# EAGLE design Adafruit Arcade Bonnet (EAGLE 6.6.0)
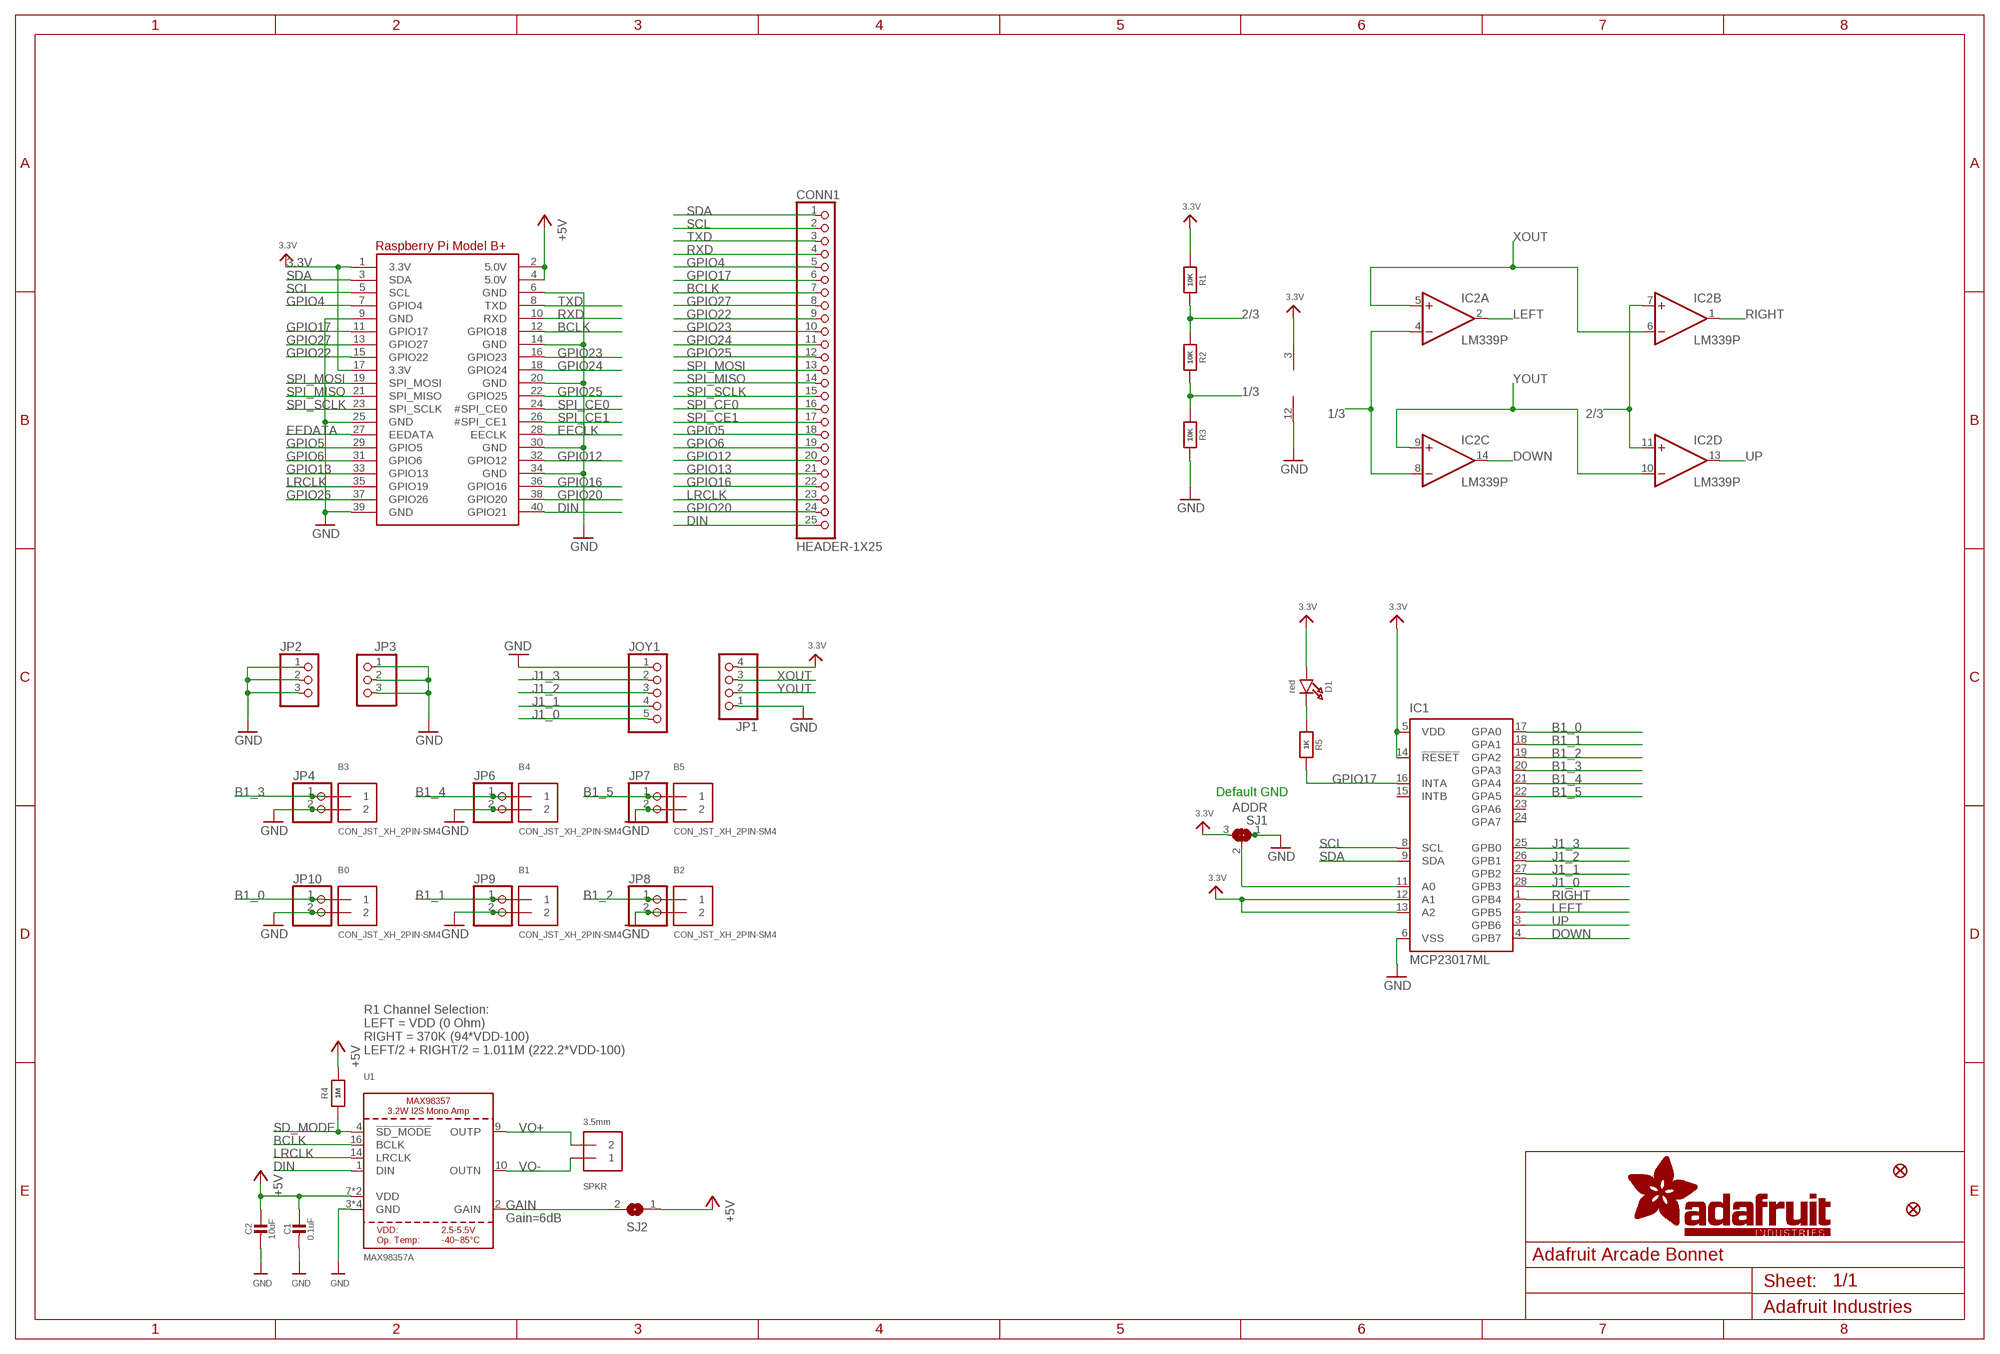
[diagram p0: schematic, sheet 1]

## Parts
B0  CON_JST_XH_2PIN-SM4  [JST-XH-2-SM4]
B1  CON_JST_XH_2PIN-SM4  [JST-XH-2-SM4]
B2  CON_JST_XH_2PIN-SM4  [JST-XH-2-SM4]
B3  CON_JST_XH_2PIN-SM4  [JST-XH-2-SM4]
B4  CON_JST_XH_2PIN-SM4  [JST-XH-2-SM4]
B5  CON_JST_XH_2PIN-SM4  [JST-XH-2-SM4]
C1  0.1uF  CAP_CERAMIC0603_NO  [0603-NO]
C2  10uF  CAP_CERAMIC0805-NOOUTLINE  [0805-NO]
CONN1  HEADER-1X25  [1X25_ROUND_70MIL]
D1  red  LED0805_NOOUTLINE  [CHIPLED_0805_NOOUTLINE]
FID2  FIDUCIAL""  [FIDUCIAL_1MM]
FID3  FIDUCIAL""  [FIDUCIAL_1MM]
IC1  MCP23017ML  [QFN28-ML_6X6MM]
IC2  LM339P  [TSSOP14]
JOY1  HEADER-1X5  [1X05_OVAL]
JP1  HEADER-1X4  [1X04_OVAL]
JP2  HEADER-1X3ROUND  [1X03_ROUND]
JP3  HEADER-1X3ROUND  [1X03_ROUND]
JP4  HEADER-1X2  [1X02_OVAL]
JP6  HEADER-1X2  [1X02_OVAL]
JP7  HEADER-1X2  [1X02_OVAL]
JP8  HEADER-1X2  [1X02_OVAL]
JP9  HEADER-1X2  [1X02_OVAL]
JP10  HEADER-1X2  [1X02_OVAL]
R1  10K  RESISTOR0805_10MGAP  [0805_10MGAP]
R2  10K  RESISTOR0805_NOOUTLINE  [0805-NO]
R3  10K  RESISTOR0805_NOOUTLINE  [0805-NO]
R4  1M  RESISTOR_0603_NOOUT  [0603-NO]
R5  1K  RESISTOR_0603_NOOUT  [0603-NO]
RPI1  RASPBERRYPI_BPLUS_PHAT  [PI_BONNET]
SJ1  ADDR  SOLDERJUMPER_2WAY  [SOLDERJUMPER_2WAY_OPEN_NOPASTE]
SJ2  SOLDERJUMPERCLOSED  [SOLDERJUMPER_CLOSEDWIRE]
SPKR  3.5mm  TERMBLOCK_1X2  [TERMBLOCK_1X2-3.5MM]
U1  MAX98357A  AUDIOAMP_MAX98357  [QFN16_3MM]

## Nets
1/3: IC2.4(A:-IN) IC2.8(C:-IN) R2.2 R3.1
2/3: IC2.7(B:+IN) IC2.11(D:+IN) R1.2 R2.1
3.3V: D1.A IC1.5(VDD) IC1.12(A1) IC1.13(A2) IC1.14(!RESET) IC2.3(P:V+) JP1.4 R1.1 RPI1.1(3.3V) RPI1.17(3.3V) SJ1.3
+5V: C1.1 C2.1 R4.2 RPI1.2(5.0V) RPI1.4(5.0V) SJ2.1 U1.7(VDD) U1.8(VDD)
B1_0: B0.1 IC1.17(GPA0) JP10.1
B1_1: B1.1 IC1.18(GPA1) JP9.1
B1_2: B2.1 IC1.19(GPA2) JP8.1
B1_3: B3.1 IC1.20(GPA3) JP4.1
B1_4: B4.1 IC1.21(GPA4) JP6.1
B1_5: B5.1 IC1.22(GPA5) JP7.1
BCLK: CONN1.7 RPI1.12(GPIO18) U1.16(BCLK)
DIN: CONN1.25 RPI1.40(GPIO21) U1.1(DIN)
DOWN: IC1.4(GPB7) IC2.14(C:OUT)
EECLK: RPI1.28(EECLK)
EEDATA: RPI1.27(EEDATA)
GAIN: SJ2.2 U1.2(GAIN)
GND: B0.2 B1.2 B2.2 B3.2 B4.2 B5.2 C1.2 C2.2 IC1.6(VSS) IC2.12(P:GND) JOY1.1 JP1.1 JP2.1 JP2.2 JP2.3 JP3.1 JP3.2 JP3.3 JP4.2 JP6.2 JP7.2 JP8.2 JP9.2 JP10.2 R3.2 RPI1.6(GND) RPI1.9(GND) RPI1.14(GND) RPI1.20(GND) RPI1.25(GND) RPI1.30(GND) RPI1.34(GND) RPI1.39(GND) SJ1.1 U1.3(GND) U1.11(GND) U1.15(GND) U1.THERMAL(GND)
GPIO4: CONN1.5 RPI1.7(GPIO4)
GPIO5: CONN1.18 RPI1.29(GPIO5)
GPIO6: CONN1.19 RPI1.31(GPIO6)
GPIO12: CONN1.20 RPI1.32(GPIO12)
GPIO13: CONN1.21 RPI1.33(GPIO13)
GPIO16: CONN1.22 RPI1.36(GPIO16)
GPIO17: CONN1.6 IC1.16(INTA) R5.2 RPI1.11(GPIO17)
GPIO20: CONN1.24 RPI1.38(GPIO20)
GPIO22: CONN1.9 RPI1.15(GPIO22)
GPIO23: CONN1.10 RPI1.16(GPIO23)
GPIO24: CONN1.11 RPI1.18(GPIO24)
GPIO25: CONN1.12 RPI1.22(GPIO25)
GPIO26: RPI1.37(GPIO26)
GPIO27: CONN1.8 RPI1.13(GPIO27)
J1_0: IC1.28(GPB3) JOY1.5
J1_1: IC1.27(GPB2) JOY1.4
J1_2: IC1.26(GPB1) JOY1.3
J1_3: IC1.25(GPB0) JOY1.2
LEFT: IC1.2(GPB5) IC2.2(A:OUT)
LRCLK: CONN1.23 RPI1.35(GPIO19) U1.14(LRCLK)
N$1: IC1.11(A0) SJ1.2
N$2: D1.C R5.1
RIGHT: IC1.1(GPB4) IC2.1(B:OUT)
RXD: CONN1.4 RPI1.10(RXD)
SCL: CONN1.2 IC1.8(SCL) RPI1.5(SCL)
SD_MODE: R4.1 U1.4(!SD_MODE)
SDA: CONN1.1 IC1.9(SDA) RPI1.3(SDA)
SPI_CE0: CONN1.16 RPI1.24(#SPI_CE0)
SPI_CE1: CONN1.17 RPI1.26(#SPI_CE1)
SPI_MISO: CONN1.14 RPI1.21(SPI_MISO)
SPI_MOSI: CONN1.13 RPI1.19(SPI_MOSI)
SPI_SCLK: CONN1.15 RPI1.23(SPI_SCLK)
TXD: CONN1.3 RPI1.8(TXD)
UP: IC1.3(GPB6) IC2.13(D:OUT)
VO+: SPKR.2 U1.9(OUTP)
VO-: SPKR.1 U1.10(OUTN)
XOUT: IC2.5(A:+IN) IC2.6(B:-IN) JP1.3
YOUT: IC2.9(C:+IN) IC2.10(D:-IN) JP1.2
Unconnected: IC1.15(INTB) IC1.23(GPA6) IC1.24(GPA7)

## Notes on the sheet
- Default GND
- R1 Channel Selection:
  LEFT = VDD (0 Ohm)
  RIGHT = 370K (94*VDD-100)
  LEFT/2 + RIGHT/2 = 1.011M (222.2*VDD-100)
- Gain=6dB

## Library data of the parts
B0 B1-B5 = microbuilder:CON_JST_XH_2PIN
C1 C2 = microbuilder:CAP_CERAMIC: Ceramic Capacitors For new designs, use the packages preceded by an '_' character since they are more reliable: The following footprints should be used on most boards: _0402 - Standard footprint for regular board layouts _0603 - Standard footprint for regular board layouts _0805 - Standard footprint for regular board layouts _1206 - Standard footprint for regular board layouts For extremely tight-pitch boards where space is at a premium, the following 'micro-pitch' footprints can be used (smaller pads, no silkscreen outline, etc.): _0402MP - Micro-pitch footprint for very dense/compact boards _0603MP - Micro-pitch footprint for very dense/compact boards _0805MP - Micro-pitch footprint for very dense/compact boards _1206MP - Micro-pitch footprint for very dense/compact boards
CONN1 = microbuilder:HEADER-1X25
D1 = microbuilder:LED: LED 0603 - 0603 Surface Mount Package 2mA: Green LED - Low Power (3.9mcd, 2ma, 1.7Vf) - Digikey: 475-2709-2-ND Orange LED - Low Power (9.8mcd, 2ma, 1.8Vf) - Digikey: 475-1194-2-ND Red LED - Low Power (5mcd, 2ma, 1.8Vf) - Digikey: 475-1195-2-ND Yellow LED - Low Power (7mcd, 2ma, 1.8Vf) - Digikey: 475-1196-2-ND 5mA: Blue LED - Low Power (17mcd, 5ma, 2.9Vf) - Digikey: LNJ937W8CRACT-ND 0805 - 0805 Surface Mount Package 2mA: Red LED (8.8mcd, 2mA, 1.8Vf, Clear) - Low Power [Digikey: 475-2510-1-ND] Green LED (5mcd, 2mA, 1.8Vf, Clear) - Low Power [Digikey: 475-2730-1-ND] Yellow LED (11.3mcd, 2mA, 1.8Vf, Clear) - Low Power [Digikey: 475-2555-1-ND] 20mA: Red LED (104mcd, 20mA, Diffused) - LS R976 [Digikey: 475-1278-6-ND] Red LED (12mcd, 20mA, 2.0Vf, Clear) - APT2012EC [Digikey: 754-1128-1-ND] Green LED (15mcd, 20mA, 2.2Vf, Clear) - APT2012GC [Digikey: 754-1131-1-ND] Orange LED (160mcd, 20mA, 2.1Vf, Clear) - APT2012SECK [Digikey: 754-1130-1-ND] 1206 - 1206 Surface Mount Package Green LED (26mcd, 20mA, Diffused) - LG N971 [Digikey: 475-1407-6-ND] Red LED (15mcd, 20mA, Diffused) - LH N974 [Digikey: 475-1416-6-ND] Cree - Cree High-Power Surface Mount LEDs XPEBWT-L1-0000-00D50 - White 111lm 350mA 2.9Vf 6200K 110° XTEAWT-00-0000-00000LEE3 - White 114lm 350mA 2.85Vf 5000K 115° Everlight - Everlight 45-21 Series Surface Mount LEDs 45-21/QK2C-B2832AC2CB2/2T - Warm White 2000mcd 20mA 3.25Vf 3050K 120° 45-21/LK2C-B38452C4CB2/2T - Nuetral White 2000mcd 20mA 3.25Vf 4150K 120° 45-21/LK2C-B50634C6CB2/2T - Cold White 2200mcd 20mA 3.25Vf 5650K 120° PLCC2 Reverse Mount LS T77K-J1L2-1-0-2-R18-Z - Red 11.25mcd 2mA 1.8Vf 630nm 120° LO T77K-L1M2-24-Z - Orange 19.6mcd 2mA 1.8Vf 606nm 120° LY T77K-K2M1-26-Z - Yellow 15.7mcd 2mA 1.8Vf 587nm 120°
FID2 FID3 = microbuilder:FIDUCIAL: Fiducial Alignment Points Various fiducial points for machine vision alignment.; BOM: EXCLUDE
IC1 = microbuilder:MCP23017: http://ww1.microchip.com/downloads/en/DeviceDoc/21952a.pdf Source: http://ww1.microchip.com/downloads/en/DeviceDoc/21952a.pdf; MF: MICROCHIP; MPN: MCP23017-E/SS; OC_FARNELL: 1467674; OC_NEWARK: 31K2960
IC2 = microbuilder:LM339: Low Power Low Offset Voltage Quad Comparators with open collector; LM139/LM239/LM339/LM2901/LM3302
JOY1 = microbuilder:HEADER-1X5: PIN HEADER
JP1 = microbuilder:HEADER-1X4: PIN HEADER
JP2 JP3 = microbuilder:HEADER-1X3: PIN HEADER
JP4 JP6-JP10 = microbuilder:HEADER-1X2: PIN HEADER
R1-R5 = microbuilder:RESISTOR: Resistors For new designs, use the packages preceded by an '_' character since they are more reliable: The following footprints should be used on most boards: _0402 - Standard footprint for regular board layouts _0603 - Standard footprint for regular board layouts _0805 - Standard footprint for regular board layouts _1206 - Standard footprint for regular board layouts For extremely tight-pitch boards where space is at a premium, the following 'micro-pitch' footprints can be used (smaller pads, no silkscreen outline, etc.): _0402MP - Micro-pitch footprint for very dense/compact boards _0603MP - Micro-pitch footprint for very dense/compact boards _0805MP - Micro-pitch footprint for very dense/compact boards _1206MP - Micro-pitch footprint for very dense/compact boards
RPI1 = microbuilder:RASPBERRYPI_BPLUS
SJ1 = microbuilder:SOLDERJUMPER_2WAY: 2-Way Solder Jumper
SJ2 = microbuilder:SOLDERJUMPER: SMD Solder JUMPER Solder the two pads together to create a connection, or remove the solder to break it. REFLOW - Use this footprint for solder paste and reflow ovens. WAVE - Use this footprint for hand-soldering (larger pads). CLOSED - Has a trace between the two pads to ensure it is closed by default. The trace needs to be cut to disable the jumper, and can be closed again by creating a solder bridge between the two pads.
SPKR = microbuilder:TERMBLOCK_1X2: 3.5mm Terminal block http://www.ladyada.net/library/pcb/eaglelibrary.html
U1 = microbuilder:AUDIOAMP_MAX98357: MAX98357 - 3.2W I2S Mono Audio Amp

## Board
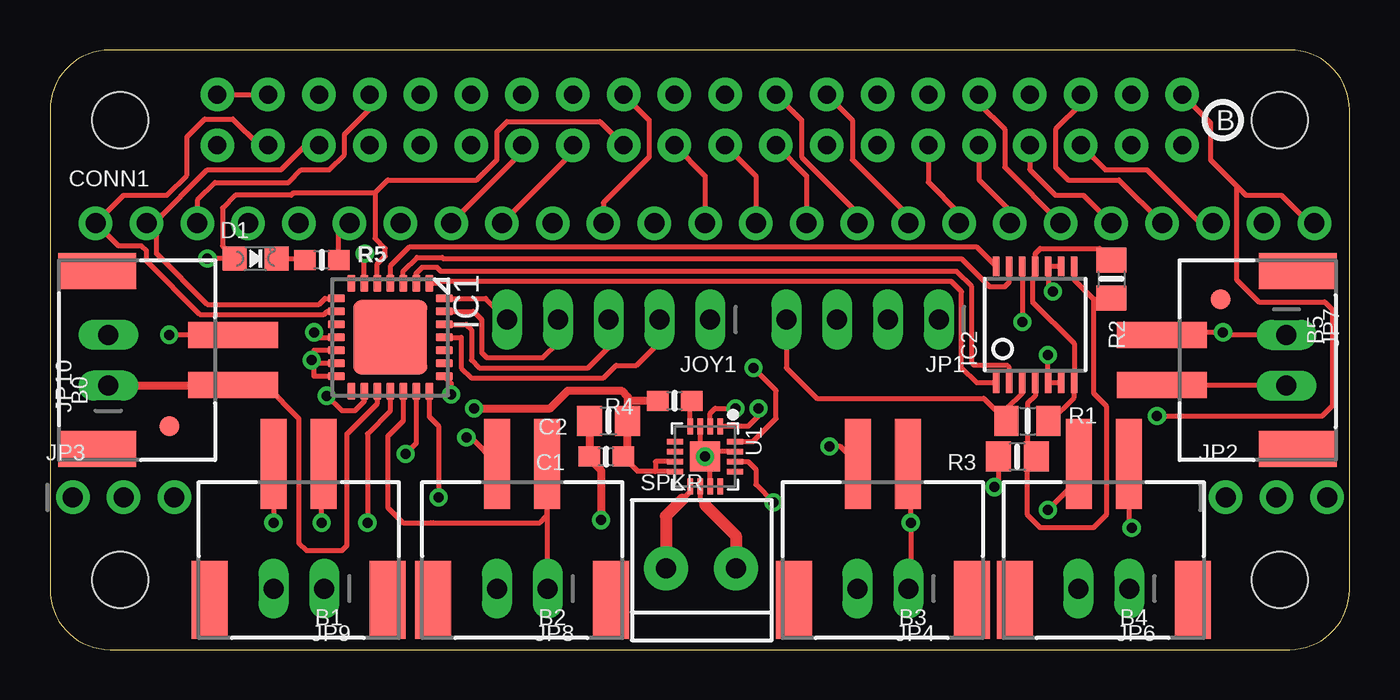
[diagram p1: board, top side]
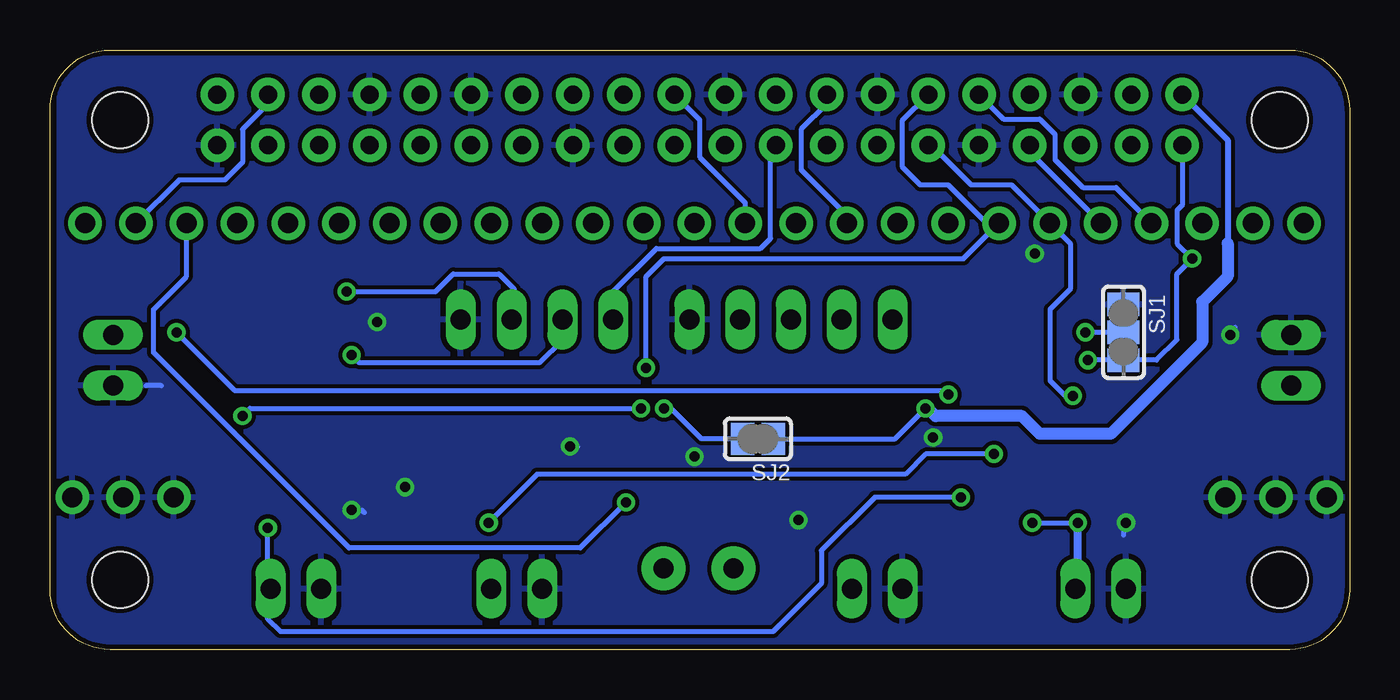
[diagram p2: board, bottom side, seen from below]

Size 65 x 30 mm. Coordinates in mm from the lower left corner, seen from the top.
Copper layers (1*16): Top 0.035mm / dielectric 1.5mm / Bottom 0.035mm
Design rules "adafruit *": minimum track width 8mil, minimum drill 15.5mil, track to track 8mil, track to pad 8mil, pad to pad 8mil, via to via 8mil, smd to smd 8mil, copper to edge 10mil, drill to drill 8mil, minimum pad ring 10mil, minimum via ring 8mil, stop-mask expansion 2mil, vias tented up to drill 20mil, thermal gap 10mil

### Footprints (pad centres in the part's own frame; a part is rotated, then mirrored left to right if it is on the bottom)
JST-XH-2-SM4 = smd 1.3 x 4.5: 1 -1.25,-2.3; 2 1.25,-2.3 | smd 1.8 x 3.9: NC1 -4.45,4.5; NC2 4.45,4.5
0603-NO = smd 1.075 x 1: 1 -0.85,0; 2 0.85,0
0805-NO = smd 1.24 x 1.5: 1 -0.95,0; 2 0.95,0
1X25_ROUND_70MIL = drill 1 pad 1.676: 1 -30.48,0; 2 -27.94,0; 3 -25.4,0; 4 -22.86,0; 5 -20.32,0; 6 -17.78,0; 7 -15.24,0; 8 -12.7,0; 9 -10.16,0; 10 -7.62,0; 11 -5.08,0; 12 -2.54,0; 13 0,0; 14 2.54,0; 15 5.08,0; 16 7.62,0; 17 10.16,0; 18 12.7,0; 19 15.24,0; 20 17.78,0; 21 20.32,0; 22 22.86,0; 23 25.4,0; 24 27.94,0; 25 30.48,0
CHIPLED_0805_NOOUTLINE = smd 1.2 x 1.2: A 0,-1.05; C 0,1.05
FIDUCIAL_1MM = smd 1 x 1: 1 0,0
QFN28-ML_6X6MM = smd 0.85 x 0.4: 1 -2.7,1.95; 2 -2.7,1.3; 3 -2.7,0.65; 4 -2.7,0; 5 -2.7,-0.65; 6 -2.7,-1.3; 7 -2.7,-1.95; 15 2.7,-1.95; 16 2.7,-1.3; 17 2.7,-0.65; 18 2.7,0; 19 2.7,0.65; 20 2.7,1.3; 21 2.7,1.95 | smd 0.4 x 0.85: 8 -1.95,-2.7; 9 -1.3,-2.7; 10 -0.65,-2.7; 11 0,-2.7; 12 0.65,-2.7; 13 1.3,-2.7; 14 1.95,-2.7; 22 1.95,2.7; 23 1.3,2.7; 24 0.65,2.7; 25 0,2.7; 26 -0.65,2.7; 27 -1.3,2.7; 28 -1.95,2.7 | smd 3.7 x 3.7: EXP 0,0
TSSOP14 = smd 0.305 x 0.991: 1 -1.95,-2.918; 2 -1.3,-2.918; 3 -0.65,-2.918; 4 0,-2.918; 5 0.65,-2.918; 6 1.3,-2.918; 7 1.95,-2.918; 8 1.95,2.918; 9 1.3,2.918; 10 0.65,2.918; 11 0,2.918; 12 -0.65,2.918; 13 -1.3,2.918; 14 -1.95,2.918
1X05_OVAL = drill 1 long: 1 -5.08,0; 2 -2.54,0; 3 0,0; 4 2.54,0; 5 5.08,0
1X04_OVAL = drill 1 long: 1 -3.81,0; 2 -1.27,0; 3 1.27,0; 4 3.81,0
1X03_ROUND = drill 1 pad 1.676: 1 -2.54,0; 2 0,0; 3 2.54,0
1X02_OVAL = drill 1 long: 1 -1.27,0; 2 1.27,0
0805_10MGAP = smd 1.2 x 1.5: 1 -1.05,0; 2 1.05,0
PI_BONNET = drill 0.9 pad 1.676: 1 8.37,25.23; 2 8.37,27.77; 3 10.91,25.23; 4 10.91,27.77; 5 13.45,25.23; 6 13.45,27.77; 7 15.99,25.23; 8 15.99,27.77; 9 18.53,25.23; 10 18.53,27.77; 11 21.07,25.23; 12 21.07,27.77; 13 23.61,25.23; 14 23.61,27.77; 15 26.15,25.23; 16 26.15,27.77; 17 28.69,25.23; 18 28.69,27.77; 19 31.23,25.23; 20 31.23,27.77; 21 33.77,25.23; 22 33.77,27.77; 23 36.31,25.23; 24 36.31,27.77; 25 38.85,25.23; 26 38.85,27.77; 27 41.39,25.23; 28 41.39,27.77; 29 43.93,25.23; 30 43.93,27.77; 31 46.47,25.23; 32 46.47,27.77; 33 49.01,25.23; 34 49.01,27.77; 35 51.55,25.23; 36 51.55,27.77; 37 54.09,25.23; 38 54.09,27.77; 39 56.63,25.23; 40 56.63,27.77 | hole 2.8: 3.5,3.5; 3.5,26.5; 61.5,26.5; 61.5,3.5
SOLDERJUMPER_2WAY_OPEN_NOPASTE = smd 1.168 x 1.6: 1 -1.397,0; 2 0,0; 3 1.397,0
SOLDERJUMPER_CLOSEDWIRE = smd 1.168 x 1.6: 1 -0.762,0; 2 0.762,0 | smd 0.635 x 0.203: WIRE 0,0
TERMBLOCK_1X2-3.5MM = drill 1 pad 2.184: 1 1.8,0; 2 -1.7,0
QFN16_3MM = smd 0.8 x 0.28: 1 -1.5,0.75; 2 -1.5,0.25; 3 -1.5,-0.25; 4 -1.5,-0.75; 9 1.5,-0.75; 10 1.5,-0.25; 11 1.5,0.25; 12 1.5,0.75 | smd 0.28 x 0.8: 5 -0.75,-1.5; 6 -0.25,-1.5; 7 0.25,-1.5; 8 0.75,-1.5; 13 0.75,1.5; 14 0.25,1.5; 15 -0.25,1.5; 16 -0.75,1.5 | smd 1.5 x 1.5: THERMAL 0,0

### Placement (x,y rotation side)
B0  6.86,14.48 90 top
B1  12.45,6.99 180 top
B2  23.62,6.99 180 top
B3  41.66,6.99 180 top
B4  52.7,6.99 180 top
B5  57.91,14.48 270 top
C1  27.81,9.65 180 top
C2  27.94,11.43 180 top
CONN1  32.77,21.34 0 top
D1  10.29,19.56 270 top
FID2  58.55,17.53 0 top
FID3  5.97,11.18 0 top
IC1  17.02,15.62 270 top
IC2  49.28,16.26 0 top
JOY1  27.94,16.51 180 top
JP1  40.64,16.51 180 top
JP2  61.34,7.62 0 top
JP3  3.68,7.62 0 top
JP4  41.66,3.05 180 top
JP6  52.7,3.05 180 top
JP7  61.85,14.48 270 top
JP8  23.62,3.05 180 top
JP9  12.45,3.05 180 top
JP10  2.92,14.48 90 top
R1  48.9,11.43 0 top
R2  53.09,18.54 270 top
R3  48.39,9.65 180 top
R4  31.24,12.45 180 top
R5  13.59,19.49 0 top
RPI1  0,0 0 top
SJ1  11.3,15.88 270 bottom
SJ2  29.59,10.54 180 bottom
SPKR  32.51,4.06 0 top
U1  32.77,9.65 270 top
U$11  [PCBFEAT-REV-040]  58.67,26.48 0 top
U$19  [BONNET_ARCADE_REVB_TOP]  0,0 0 top
U$20  [BONNET_ARCADE_REVB_BOT]  65.02,0 0 bottom

### Tracks (layer width: path | path; a pad name or v marks a point on that pad's centre or on a via)
1/3
  Top 0.254: IC2.8 51.23,18.5 52.2,17.53 | 52.2,17.53 53.15,17.53 | 53.59,17.53 53.15,17.53 | 53.15,17.53 R2.2 | IC2.4 49.28,12.7 48.9,12.32 48.9,9.97 49.02,9.97 R3.1 48.9,9.21 48.9,6.73 49.53,6.1 52.2,6.1 52.83,6.73 52.83,12.19 52.2,12.83 52.2,17.53
2/3
  Top 0.254: R1.2 50.04,11.43 51.23,12.62 IC2.7 51.23,15.32 49.15,17.4 49.15,18.54 49.28,18.67 IC2.11 49.28,19.81 49.53,20.07 52.51,20.07 R2.1
3.3V  (via drill 0.5)
  Top 0.254: 13.21,14.32 13.21,14.35 | 13.21,14.35 13.21,14.97 IC1.12 | IC1.14 13.21,13.67 13.21,14.32 | 13.18,14.35 13.21,14.32 | 16.26,22.86 16.89,23.5 21.34,23.5 22.35,24.51 22.35,25.91 22.86,26.42 27.5,26.42 RPI1.17 | IC2.3 48.63,12.81 47.84,12.03 R1.1 46.7,12.57 38.35,12.57 36.83,14.1 JP1.4 | IC1.13 13.24,14.32 13.21,14.35 | 13.21,14.35 v13.08,14.48 | 16.26,22.86 16.26,20.58 16.76,20.07 16.76,19.68 16.37,19.29 IC1.5 | 16.26,22.86 12.19,22.86 12.06,22.73 9.27,22.73 8.64,22.1 8.64,20.19 9.27,19.56 D1.A v7.87,19.56
  Bottom 0.254: RPI1.1 8.37,22.24 8.64,21.97 8.64,20.32 v7.87,19.56 8.64,18.8 8.64,15.49 9.65,14.48 SJ1.3 v13.08,14.48 | JP1.4 36.83,17.91 34.67,20.07 29.46,20.07 28.96,20.57 28.96,24.96 RPI1.17
+5V  (via drill 0.5)
  Top 0.254: RPI1.2 RPI1.4 | U1.8 30.27,8.9 30.27,8.93 | C1.1 29.39,8.93 30.27,8.93 | U1.7 30.27,9.4 30.27,8.93
  Top 0.406: v21.21,12.06 25.02,12.06 25.91,12.95 28.57,12.95 28.89,12.64 28.89,12.45 | 28.89,12.45 C2.1 28.89,9.65 C1.1 | R4.2 28.89,12.45
  Bottom 0.254: SJ2.1 22.73,10.54 v21.21,12.06
  Bottom 0.305: RPI1.2 6.1,25.5 6.1,20.32
  Bottom 0.61: 6.1,20.32 6.1,18.67 7.37,17.4 7.37,15.37 11.94,10.79 15.49,10.79 16.38,11.68 20.7,11.68 21.08,12.06 v21.21,12.06
B1_0
  Top 0.254: IC1.17 16.38,12.91 16.38,12.32 14.86,10.79 14.86,5.21 14.61,4.95 12.83,4.95 12.45,5.33 12.45,11.56 10.78,13.23 B0.1
  Top 0.406: JP10.1 9.16,13.21 B0.1
B1_1  (via drill 0.5)
  Top 0.254: 13.7,9.76 B1.1 13.59,9.18 v13.59,6.35 | IC1.18 17.02,11.94 15.88,10.79 v15.88,6.35
  Bottom 0.254: v15.88,6.35 v13.59,6.35
  Bottom 0.406: JP9.1 13.59,3.05 v13.59,6.35
B1_2
  Top 0.254: JP8.1 24.89,9.27 B2.1 24.87,6.71 24.51,6.35 19.18,6.35 19.05,6.35 17.65,6.35 16.89,7.11 16.89,10.67 17.67,11.45 IC1.19
B1_3  (via drill 0.5)
  Top 0.254: B3.1 43.05,9.14 v43.05,6.35 43.05,3.17 JP4.1 | IC1.20 18.32,10.32 v17.78,9.78
  Bottom 0.254: v17.78,9.78 21.21,9.78 22.23,8.76 40.64,8.76 v43.05,6.35
B1_4  (via drill 0.5)
  Top 0.254: v19.43,7.62 19.43,11.19 18.97,11.65 IC1.21 | B4.1 53.95,6.24 v54.1,6.1
  Bottom 0.254: v19.43,7.62 23.75,7.62 26.42,4.95 26.42,3.3 28.83,0.89 53.47,0.89 54.1,1.52 54.1,2.92 JP6.1 54.1,3.17 v54.1,6.1
B1_5  (via drill 0.5)
  Top 0.254: B5.1 55.76,15.88 v58.67,15.88 58.8,15.75 JP7.1 | IC1.22 20.07,13.32 v20.07,12.76
  Bottom 0.254: v58.67,15.88 55.75,12.95 20.26,12.95 v20.07,12.76
BCLK  (via drill 0.5)
  Top 0.254: U1.16 35.17,10.4 36.32,11.56 36.32,12.95 v35.18,14.1
  Bottom 0.254: v35.18,14.1 35.18,18.67 34.29,19.56 19.3,19.56 CONN1.7 18.16,21.34 20.07,23.24 21.46,23.24 22.35,24.13 22.35,26.49 RPI1.12
DIN  (via drill 0.5)
  Top 0.254: RPI1.40 58.04,26.36 58.04,24.51 59.37,23.18 | 59.37,23.18 59.82,22.73 61.59,22.73 62.99,21.34 CONN1.25 | v55.37,11.68 63.63,11.68 64.14,12.19 64.14,17.02 63.75,17.4 60.45,17.4 59.37,18.48 59.37,23.18 | v35.43,12.06 35.43,11.68 34.92,11.18 34.92,11.16 33.53,11.16 U1.1
  Bottom 0.254: v35.43,12.06 54.99,12.06 v55.37,11.68
DOWN
  Top 0.254: IC2.14 46.37,20.13 17.97,20.13 17.02,19.18 IC1.4
GAIN  (via drill 0.5)
  Top 0.254: U1.2 33.02,11.81 33.27,12.06 v34.29,12.06
  Bottom 0.254: SJ2.2 32.41,10.54 33.93,12.06 v34.29,12.06
GND  (via drill 0.5)
  Top 0.254: U1.15 33.02,9.9 U1.THERMAL | U1.3 32.52,9.9 U1.THERMAL | U1.11 33.02,9.4 U1.THERMAL | B3.2 39.53,10.16 v38.99,10.16 | B1.2 11.18,9.27 v11.18,6.35 | B0.2 5.99,15.73 v5.97,15.75 | B5.2 61.83,13.23 JP7.2 | IC2.12 48.63,16.38 v48.64,16.38 | IC1.6 15.72,19.78 v15.75,19.81 | B2.2 21.05,10.6 v20.83,10.6 | R3.2 47.44,8.32 v47.24,8.13 | B4.2 51.45,8.53 v49.91,6.99
  Top 0.406: v27.56,6.48 27.56,8.98 26.96,9.57 C1.2 26.96,9.85 26.99,9.88 C2.2
  Bottom 0.254: v38.99,10.16 38.61,10.16 | v11.18,6.35 11.3,6.22 11.3,5.71 | v5.97,15.75 5.97,15.88 5.71,16.13 | v27.56,6.48 27.69,6.6 | v49.91,6.99 49.4,6.99 49.28,6.86 | 59.44,13.21 60.2,13.21 | v48.64,16.38 48.64,16.26 48.51,16.26
  other vias: 32.77,9.65
  pour Bottom: 0,30.23 0,0 64.52,0 64.52,30.23
GPIO4
  Bottom 0.254: CONN1.5 15.99,24.88 RPI1.7
GPIO5
  Top 0.254: RPI1.29 43.93,23.38 45.47,21.84 CONN1.18
GPIO6
  Top 0.254: RPI1.31 46.47,23.51 48.01,21.97 CONN1.19
GPIO12
  Top 0.254: RPI1.32 46.47,27.32 47.75,26.04 47.75,24.13 CONN1.20
GPIO13
  Top 0.254: RPI1.33 49.01,24.02 50.29,22.73 51.69,22.73 CONN1.21
GPIO16
  Top 0.254: RPI1.36 51.55,27.29 50.29,26.04 50.29,24.13 50.93,23.5 53.47,23.5 CONN1.22
GPIO17  (via drill 0.5)
  Top 0.254: IC1.16 15.72,12.42 15.24,11.94 14.61,11.94 v13.84,12.7 | R5.2 14.44,20.79 CONN1.6
  Bottom 0.254: RPI1.11 20.91,25.23 18.92,23.24 16.89,23.24 CONN1.6 13.97,20.32 13.97,18.03 14.99,17.02 14.99,13.46 14.22,12.7 v13.84,12.7
GPIO20
  Bottom 0.254: RPI1.38 54.09,27.32 55.37,26.04 55.37,24.38 56.26,23.5 58.55,23.5 CONN1.24
GPIO22
  Top 0.254: RPI1.15 26.15,24.88 CONN1.9
GPIO23
  Bottom 0.254: RPI1.16 26.15,27.32 27.43,26.04 27.43,24 25.15,21.72 CONN1.10
GPIO24
  Top 0.254: RPI1.18 29.97,26.49 29.97,24.64 27.69,22.35 CONN1.11
GPIO25
  Bottom 0.254: RPI1.22 32.51,26.51 32.51,24.64 30.23,22.35 CONN1.12
GPIO27
  Top 0.254: RPI1.13 23.61,24.88 CONN1.8
J1_0
  Top 0.254: IC1.28 21.8,17.57 JOY1.5
J1_1
  Top 0.254: IC1.27 21.18,16.92 21.59,16.51 21.59,14.86 21.84,14.61 24.64,14.61 25.4,15.37 JOY1.4
J1_2
  Top 0.254: IC1.26 20.81,16.27 21.08,16 21.08,14.48 21.46,14.1 26.92,14.1 27.94,15.11 JOY1.3
J1_3
  Top 0.254: IC1.25 20.57,15.62 20.57,14.1 21.08,13.59 27.69,13.59 28.32,14.22 29.34,14.22 30.48,15.37 JOY1.2
LEFT
  Top 0.254: IC2.2 47.98,14.13 47.88,14.22 46.23,14.22 46.1,14.35 46.1,18.16 45.34,18.92 19.56,18.92 19.37,19.11 18.61,19.11 18.29,18.8 18.29,18.35 IC1.2
LRCLK  (via drill 0.5)
  Top 0.254: U1.14 34.92,9.4 35.31,9.02 35.31,8.26 v36.2,7.37 | RPI1.35 52.78,24 54.86,24 57.53,21.34 CONN1.23
  Bottom 0.254: v36.2,7.37 38.48,5.08 50.04,5.08 59.82,14.86 59.82,17.02 58.17,18.67 CONN1.23
N$1  (via drill 0.5)
  Top 0.254: v13.21,15.88 13.46,15.62 IC1.11
  Bottom 0.254: v13.21,15.88 SJ1.2 11.3,16 11.43,16.13 11.43,17.27
N$2
  Top 0.254: D1.C 12.74,19.56 R5.1
RIGHT
  Top 0.254: IC2.1 46.35,13.34 45.59,14.1 45.59,17.91 45.09,18.41 19.56,18.41 19.46,18.32 IC1.1
RXD
  Bottom 0.254: RPI1.10 17.3,26.54 15.49,26.54 14.73,25.78 14.73,24.51 13.34,23.11 11.68,23.11 CONN1.4
SCL
  Top 0.254: RPI1.5 12.78,25.23 11.56,24 7.87,24 5.21,21.34 CONN1.2 5.33,20.83 5.33,19.81 7.87,17.27 13.46,17.27 13.76,17.57 IC1.8
SD_MODE
  Top 0.254: U1.4 32.02,12.37 R4.1
SDA
  Top 0.254: RPI1.3 10.46,25.23 9.14,26.54 7.75,26.54 6.86,25.65 6.86,23.75 5.84,22.73 3.68,22.73 CONN1.1 3.43,20.19 4.57,20.19 4.83,19.94 4.83,19.43 7.49,16.76 13.72,16.76 13.87,16.92 IC1.9
SPI_CE0
  Top 0.254: RPI1.24 37.59,26.49 37.59,24.64 40.39,21.84 CONN1.16
SPI_CE1
  Top 0.254: RPI1.26 40.13,26.49 40.13,24.51 42.93,21.72 CONN1.17
SPI_MISO
  Top 0.254: RPI1.21 35.31,23.69 CONN1.14
SPI_MOSI
  Top 0.254: RPI1.19 32.77,23.69 CONN1.13
SPI_SCLK
  Top 0.254: RPI1.23 37.85,23.69 CONN1.15
TXD
  Top 0.254: RPI1.8 15.99,27.04 14.73,25.78 14.73,24.77 13.97,24 12.57,24 11.94,23.37 8.26,23.37 7.37,22.48 CONN1.3
UP
  Top 0.254: IC1.3 17.67,18.94 18.35,19.62 19.62,19.62 19.68,19.56 45.59,19.56 46.99,18.16 47.75,18.16 47.98,18.39 IC2.13
VO+
  Top 0.254: U1.9 32.02,7.89 31.62,7.49
  Top 0.61: 31.62,7.49 30.81,6.68 SPKR.2
VO-
  Top 0.254: U1.10 32.52,7.49 32.77,7.24
  Top 0.61: 32.77,7.24 34.31,5.69 SPKR.1
XOUT  (via drill 0.5)
  Top 0.254: IC2.6 IC2.5 49.91,13.35 v49.91,14.73
  Bottom 0.254: v49.91,14.73 49.53,14.35 40.51,14.35 39.37,15.49 JP1.3
YOUT  (via drill 0.5)
  Top 0.254: IC2.9 IC2.10 49.93,18.15 v50.16,17.91
  Bottom 0.254: v50.16,17.91 45.72,17.91 44.83,18.8 42.55,18.8 41.78,18.03 41.78,16.64 JP1.2